# EAGLE schematic power jack (EAGLE 7.1.0)
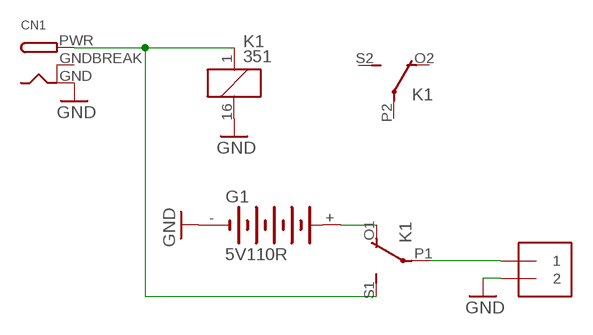
[diagram p0: schematic, sheet 1]

## Parts
CN1  DCBARRELPTH  [DCJACK_2MM_PTH]
G1  5V110R  [5V110R]
K1  351  [351]
PI  1X2-3.5MM  [1X2-3.5MM]

## Nets
GND: CN1.GND G1.- K1.16 PI.2
N$1: CN1.PWR K1.1 K1.S1(2:S)
N$2: G1.+ K1.O1(2:O)
N$3: K1.P1(2:P) PI.1
Unconnected: G1.+@1(+) K1.O2(3:O) K1.P2(3:P) K1.S2(3:S)

## Power pins joined to a net without a drawn wire
GNDBREAK: CN1.GNDBREAK

## Library data of the parts
CN1 = adafruit:DCBARREL: 2.0mm DC Barrel Jack DCJACK_2MM_PTH - Through Hole Jack (4UConnector: 05537)
G1 = battery:5V110R: NC ACCU Varta
K1 = relay:351: RELAY 2 x switch, Omron; OC_FARNELL: unknown; OC_NEWARK: unknown
PI = adafruit:1X2: 3.5mm Terminal block http://www.ladyada.net/library/pcb/eaglelibrary.html